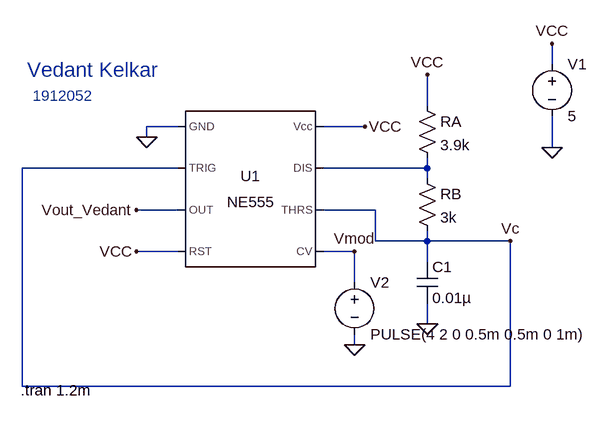
[diagram p0: schematic CS_LabX.asc]
CS_LabX.asc, the LTspice schematic file:
Version 4
SHEET 1 880 680
WIRE 656 0 656 -32
WIRE 464 64 464 16
WIRE 80 96 32 96
WIRE 368 96 304 96
WIRE 32 112 32 96
WIRE 656 128 656 80
WIRE 80 160 -160 160
WIRE 464 160 464 144
WIRE 464 160 304 160
WIRE 464 176 464 160
WIRE 80 224 16 224
WIRE 384 224 304 224
WIRE 384 272 384 224
WIRE 464 272 464 256
WIRE 464 272 384 272
WIRE 592 272 464 272
WIRE 80 288 16 288
WIRE 352 288 304 288
WIRE 464 304 464 272
WIRE 352 336 352 288
WIRE 464 400 464 368
WIRE 352 432 352 416
WIRE -160 496 -160 160
WIRE 592 496 592 272
WIRE 592 496 -160 496
FLAG 464 400 0
FLAG 656 128 0
FLAG 368 96 VCC
FLAG 464 16 VCC
FLAG 656 -32 VCC
FLAG 352 432 0
FLAG 32 112 0
FLAG 16 288 VCC
FLAG 16 224 Vout_Vedant
FLAG 592 272 Vc
FLAG 352 288 Vmod
SYMBOL Misc\\NE555 192 192 R0
SYMATTR InstName U1
SYMBOL res 448 160 R0
SYMATTR InstName RB
SYMATTR Value 3k
SYMBOL res 448 48 R0
SYMATTR InstName RA
SYMATTR Value 3.9k
SYMBOL cap 448 304 R0
SYMATTR InstName C1
SYMATTR Value 0.01µ
SYMBOL voltage 656 -16 R0
SYMATTR InstName V1
SYMATTR Value 5
SYMBOL voltage 352 320 R0
WINDOW 123 0 0 Left 0
WINDOW 39 0 0 Left 0
SYMATTR InstName V2
SYMATTR Value PULSE(4 2 0 0.5m 0.5m 0 1m)
TEXT -152 8 Left 3 ;Vedant Kelkar
TEXT -144 48 Left 2 ;1912052
TEXT -162 502 Left 2 !.tran 1.2m

The netlist it stands for:
* CS_LabX.asc
XU1 0 Vc Vout_Vedant VCC Vmod Vc N001 VCC NE555  ; pins GND TRIG OUT RST CV THRS DIS Vcc
RB N001 Vc 3k
RA VCC N001 3.9k
C1 Vc 0 0.01µ
V1 VCC 0 5
V2 Vmod 0 PULSE(4 2 0 0.5m 0.5m 0 1m)
* Vedant Kelkar
* 1912052
.tran 1.2m
.lib NE555.sub
.backanno
.end